# Altium project EtherIOv2.PrjPcb
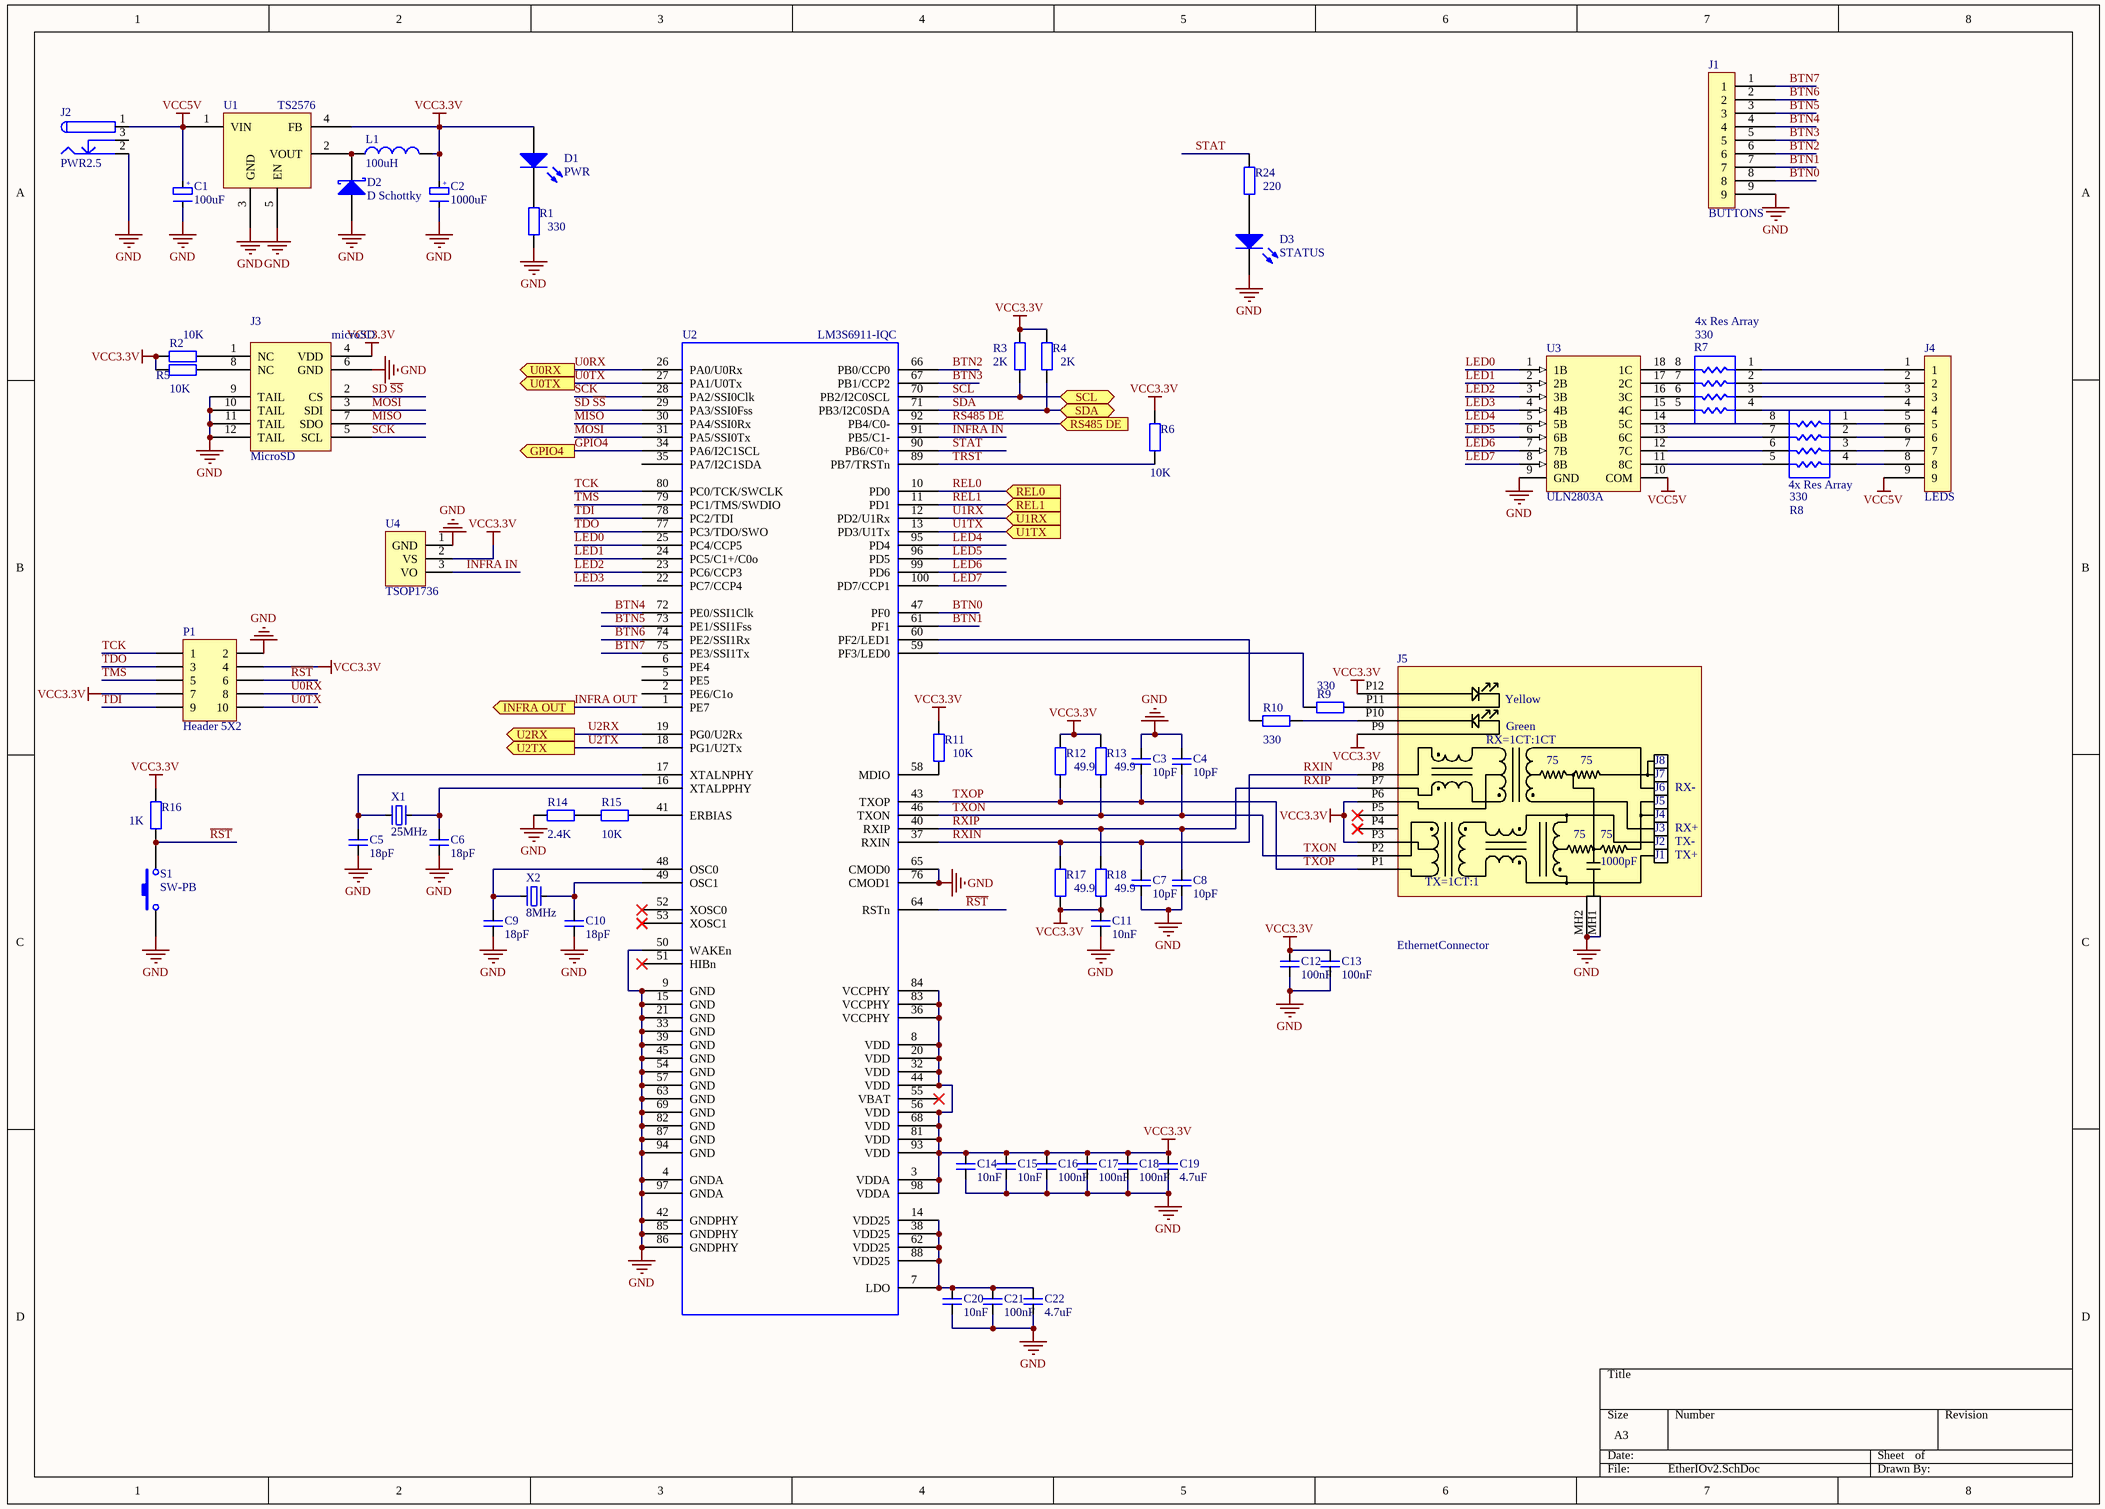
[diagram p0: EtherIOv2.SchDoc]
1 sheet, 58 parts. Net scope: flat (ports and power ports of the same name join across sheets).
Board file: EtherIOv2.PcbDoc

## Sheet EtherIOv2.SchDoc
size A3; PageSetup: Record=PageOptions|CenterHorizontal=True|CenterVertical=True|PrintScale=0.70|XCorrection=1.00|YCorrection=1.00|PrintKind=0|BorderSize=5000000|LeftOffset=0|BottomOffset=0|Orientation=2|PaperLength=1000|PaperWidth=1000|Scale=100|PaperSource=7|PrintQuality=-4|MediaType=1|DitherType=10|PaperKind=Letter|PrintScaleMode=1

### Parts
C1  value 100uF  [Electrolit Cap F80]  (hidden comment: 100uF_25V)
C2  value 1000uF  [Electrolit Cap J10]  (hidden comment: 1000uF_6V3)
C3  value 10pF  [0805 CAP]  (hidden comment: CAP)
C4  value 10pF  [0805 CAP]  (hidden comment: CAP)
C5  value 18pF  [0805 CAP]  (hidden comment: CAP)
C6  value 18pF  [0805 CAP]  (hidden comment: CAP)
C7  value 10pF  [0805 CAP]  (hidden comment: CAP)
C8  value 10pF  [0805 CAP]  (hidden comment: CAP)
C9  value 18pF  [0805 CAP]  (hidden comment: CAP)
C10  value 18pF  [0805 CAP]  (hidden comment: CAP)
C11  value 10nF  [0805 CAP]  (hidden comment: CAP)
C12  value 100nF  [0805 CAP]  (hidden comment: CAP)
C13  value 100nF  [0805 CAP]  (hidden comment: CAP)
C14  value 10nF  [0805 CAP]  (hidden comment: CAP)
C15  value 10nF  [0805 CAP]  (hidden comment: CAP)
C16  value 100nF  [0805 CAP]  (hidden comment: CAP)
C17  value 100nF  [0805 CAP]  (hidden comment: CAP)
C18  value 100nF  [0805 CAP]  (hidden comment: CAP)
C19  value 4.7uF  [0805 CAP]  (hidden comment: CAP)
C20  value 10nF  [0805 CAP]  (hidden comment: CAP)
C21  value 100nF  [0805 CAP]  (hidden comment: CAP)
C22  value 4.7uF  [0805 CAP]  (hidden comment: CAP)
D1  PWR  [0805 LED]
D2  D Schottky  [DSO-C2/X2.3]
D3  STATUS  [LED-1]
J1  BUTTONS  [Euroblock 3.5pitch 9P]
J2  PWR2.5  [KLD-0202]
J3  MicroSD  [microSD]
J4  LEDS  [Euroblock 3.5pitch 9P]
J5  EthernetConnector  [LU1T516-43]
L1  100uH  [INDP127127X85N]
P1  Header 5X2  [IDC2.54-V10D]
R1  value 330  [0805 RES]  (hidden comment: RES)
R2  value 10K  [0805 RES]  (hidden comment: RES)
R3  value 2K  [0805 RES]  (hidden comment: RES)
R4  value 2K  [0805 RES]  (hidden comment: RES)
R5  value 10K  [0805 RES]  (hidden comment: RES)
R6  value 10K  [0805 RES]  (hidden comment: RES)
R7  4x Res Array  value 330  [1206 4xRES ARRAY]
R8  4x Res Array  value 330  [1206 4xRES ARRAY]
R9  value 330  [0805 RES]  (hidden comment: RES)
R10  value 330  [0805 RES]  (hidden comment: RES)
R11  value 10K  [0805 RES]  (hidden comment: RES)
R12  value 49.9  [0805 RES]  (hidden comment: RES)
R13  value 49.9  [0805 RES]  (hidden comment: RES)
R14  value 2.4K  [0805 RES]  (hidden comment: RES)
R15  value 10K  [0805 RES]  (hidden comment: RES)
R16  value 1K  [0805 RES]  (hidden comment: RES)
R17  value 49.9  [0805 RES]  (hidden comment: RES)
R18  value 49.9  [0805 RES]  (hidden comment: RES)
R24  value 220  [0805 RES]  (hidden comment: RES)
S1  SW-PB  [SPST-2]
U1  TS2576  [TO-263-5L]
U2  LM3S6911-IQC  [QFP50P1600X1600X160-100N]
U3  ULN2803A  [SOIC127P1030X265-18N]
U4  TSOP1736  [TSOP17xx]
X1  value 25MHz  [CRYSTAL_LOW]  (hidden comment: CRYSTAL)
X2  value 8MHz  [CRYSTAL_LOW]  (hidden comment: CRYSTAL)

### Ports
GPIO4, INFRA OUT, REL0, REL1, RS485 DE, SCL, SDA, U0RX, U0TX, U1RX, U1TX, U2RX, U2TX

### Nets
GND: C1.1(B) C2.1(B) C3.2(B) C4.2(B) C5.1(A) C6.1(A) C7.2(B) C8.2(B) C9.1(A) C10.1(A) C11.1(A) C12.2(B) C13.2(B) C14.1(A) C15.1(A) C16.1(A) C17.1(A) C18.1(A) C19.1(A) C20.1(A) C21.1(A) C22.1(A) D2.1(A) D3.2(K) J1.9 J2.2 J3.6(GND) J3.9(TAIL) J3.10(TAIL) J3.11(TAIL) J3.12(TAIL) J5.MH1(SHIELD) J5.MH2(SHIELD) P1.2 R1.1 R14.1 S1.1 U1.3(GND) U1.5(EN) U2.4(GNDA) U2.9(GND) U2.15(GND) U2.21(GND) U2.33(GND) U2.39(GND) U2.42(GNDPHY) U2.45(GND) U2.50(WAKEn) U2.54(GND) U2.57(GND) U2.63(GND) U2.65(CMOD0) U2.69(GND) U2.76(CMOD1) U2.82(GND) U2.85(GNDPHY) U2.86(GNDPHY) U2.87(GND) U2.94(GND) U2.97(GNDA) U3.9(GND) U4.1(GND)
VCC3.3V: C2.2(A) C11.2(B) C12.1(A) C13.1(A) C14.2(B) C15.2(B) C16.2(B) C17.2(B) C18.2(B) C19.2(B) D1.1(A) J3.4(VDD) J5.P3 J5.P6 J5.P9 J5.P12 L1.2 P1.4 P1.7 R2.2 R3.2 R4.2 R5.2 R6.2 R11.2 R12.2 R13.2 R16.2 R17.2 R18.2 U1.4(FB) U2.3(VDDA) U2.8(VDD) U2.20(VDD) U2.32(VDD) U2.36(VCCPHY) U2.44(VDD) U2.56(VDD) U2.68(VDD) U2.81(VDD) U2.83(VCCPHY) U2.84(VCCPHY) U2.93(VDD) U2.98(VDDA) U4.2(VS)
VCC5V: C1.2(A) J2.1 J4.9 U1.1(VIN) U3.10(COM)
BTN0: J1.8 U2.47(PF0)
BTN1: J1.7 U2.61(PF1)
BTN2: J1.6 U2.66(PB0/CCP0)
BTN3: J1.5 U2.67(PB1/CCP2)
BTN4: J1.4 U2.72(PE0/SSI1Clk)
BTN5: J1.3 U2.73(PE1/SSI1Fss)
BTN6: J1.2 U2.74(PE2/SSI1Rx)
BTN7: J1.1 U2.75(PE3/SSI1Tx)
GPIO4: U2.34(PA6/I2C1SCL) ; port GPIO4
INFRA IN: U2.91(PB5/C1-) U4.3(VO)
INFRA OUT: U2.1(PE7) ; port INFRA OUT
LED0: U2.25(PC4/CCP5) U3.1(1B)
LED1: U2.24(PC5/C1+/C0o) U3.2(2B)
LED2: U2.23(PC6/CCP3) U3.3(3B)
LED3: U2.22(PC7/CCP4) U3.4(4B)
LED4: U2.95(PD4) U3.5(5B)
LED5: U2.96(PD5) U3.6(6B)
LED6: U2.99(PD6) U3.7(7B)
LED7: U2.100(PD7/CCP1) U3.8(8B)
MISO: J3.7(SDO) U2.30(PA4/SSI0Rx)
MOSI: J3.3(SDI) U2.31(PA5/SSI0Tx)
~{RST}: P1.6 R16.1 S1.2 U2.64(RSTn)
REL0: U2.10(PD0) ; port REL0
REL1: U2.11(PD1) ; port REL1
RS485 DE: U2.92(PB4/C0-) ; port RS485 DE
RXIN: C7.1(A) J5.P8 R17.1 U2.37(RXIN)
RXIP: C8.1(A) J5.P7 R18.1 U2.40(RXIP)
SCK: J3.5(SCL) U2.28(PA2/SSI0Clk)
SCL: R3.1 U2.70(PB2/I2C0SCL) ; port SCL
SD ~{SS}: J3.2(CS) U2.29(PA3/SSI0Fss)
SDA: R4.1 U2.71(PB3/I2C0SDA) ; port SDA
STAT: R24.2 U2.90(PB6/C0+)
~{TRST}: R6.1 U2.89(PB7/TRSTn)
TCK: P1.1 U2.80(PC0/TCK/SWCLK)
TDI: P1.9 U2.78(PC2/TDI)
TDO: P1.3 U2.77(PC3/TDO/SWO)
TMS: P1.5 U2.79(PC1/TMS/SWDIO)
TXON: C4.1(A) J5.P2 R13.1 U2.46(TXON)
TXOP: C3.1(A) J5.P1 R12.1 U2.43(TXOP)
U0RX: P1.8 U2.26(PA0/U0Rx) ; port U0RX
U0TX: P1.10 U2.27(PA1/U0Tx) ; port U0TX
U1RX: U2.12(PD2/U1Rx) ; port U1RX
U1TX: U2.13(PD3/U1Tx) ; port U1TX
U2RX: U2.19(PG0/U2Rx) ; port U2RX
U2TX: U2.18(PG1/U2Tx) ; port U2TX
NetC5_2: C5.2(B) U2.17(XTALNPHY) X1.1(A)
NetC6_2: C6.2(B) U2.16(XTALPPHY) X1.2(B)
NetC9_2: C9.2(B) U2.48(OSC0) X2.1(A)
NetC10_2: C10.2(B) U2.49(OSC1) X2.2(B)
NetC20_2: C20.2(B) C21.2(B) C22.2(B) U2.7(LDO) U2.14(VDD25) U2.38(VDD25) U2.62(VDD25) U2.88(VDD25)
NetD1_2: D1.2(K) R1.2
NetD2_2: D2.2(K) L1.1 U1.2(VOUT)
NetD3_1: D3.1(A) R24.1
NetJ3_1: J3.1(NC) R2.1
NetJ3_8: J3.8(NC) R5.1
NetJ4_1: J4.1 R7.1
NetJ4_2: J4.2 R7.2
NetJ4_3: J4.3 R7.3
NetJ4_4: J4.4 R7.4
NetJ4_5: J4.5 R8.1
NetJ4_6: J4.6 R8.2
NetJ4_7: J4.7 R8.3
NetJ4_8: J4.8 R8.4
NetJ5_P10: J5.P10 R10.2
NetJ5_P11: J5.P11 R9.2
NetR7_5: R7.5 U3.15(4C)
NetR7_6: R7.6 U3.16(3C)
NetR7_7: R7.7 U3.17(2C)
NetR7_8: R7.8 U3.18(1C)
NetR8_5: R8.5 U3.11(8C)
NetR8_6: R8.6 U3.12(7C)
NetR8_7: R8.7 U3.13(6C)
NetR8_8: R8.8 U3.14(5C)
NetR9_1: R9.1 U2.59(PF3/LED0)
NetR10_1: R10.1 U2.60(PF2/LED1)
NetR11_1: R11.1 U2.58(MDIO)
NetR14_2: R14.2 R15.1
NetR15_2: R15.2 U2.41(ERBIAS)

Not connected (* = marked no-connect by the designer): J2 3; J5 P4* P5*; U2 2(PE6/C1o) 5(PE5) 6(PE4) 35(PA7/I2C1SDA) 51(HIBn)* 52(XOSC0)* 53(XOSC1)* 55(VBAT)*

### Notes on the sheet
- (in symbol 100uF_25V) +
- (in symbol 1000uF_6V3) +
- (in symbol EthernetConnector) Yellow; Green; RX=1CT:1CT; 75; J8; J7; J6; RX-; J4; J3; RX+; J2; TX-; J1; TX+; 1000pF; TX=1CT:1
- (in symbol MicroSD) microSD

### Library data of the parts
C1 = 100uF_25V: SMD Electrolit Capacitor
C2 = 1000uF_6V3: SMD Electrolit Capacitor
C3-C22 = CAP: Capacitor
D1 = LED2: Typical RED, GREEN, YELLOW, AMBER GaAs LED; Published: 8-Jun-2000; LatestRevisionDate: 17-Jul-2002; LatestRevisionNote: Re-released for DXP Platform.; PackageVersion: Feb-2002; PackageReference: 3.2X1.6X1.1; Publisher: Altium Limited
D2 = D Schottky: Schottky Diode; Published: 8-Jun-2000; LatestRevisionDate: 17-Jul-2002; LatestRevisionNote: Re-released for DXP Platform.; PackageReference: SMB; Publisher: Altium Limited; Code_JEDEC: DO-214-AA
D3 = LED1: Typical RED GaAs LED; Published: 8-Jun-2000; LatestRevisionDate: 08-Jul-2005; LatestRevisionNote: Mech Layer 1 removed.; PackageReference: LED-1; Publisher: Altium Limited
J1 J4 = Euroblock 9P connector
J2 = PWR2.5: Low Voltage Power Supply Connector; Published: 17-Dec-2003; DatasheetDocument: 09-May-2002; Publisher: Altium Limited; ComponentLink1Description: Manufacturer Link; ComponentLink1URL: http://domino.kycon.com/internet/Products.html
L1 = Inductor: Code_IEC: 1005; Published: 8-Jun-2000; LatestRevisionDate: 29-May-2009; LatestRevisionNote: IPC-7351 Footprint Added.; PackageReference: 0402-A; Publisher: Altium Limited; PackageDescription: Chip Inductor; Code_JEITA: 0402
P1 = Header 5X2: Header, 5-Pin, Dual row; LatestRevisionDate: 17-Jul-2002; LatestRevisionNote: Re-released for DXP Platform.; Publisher: Altium Limited
R1-R6 R9-R18 R24 = RES: Resistor; Published: 8-Jun-2000; LatestRevisionDate: 17-Jul-2002; LatestRevisionNote: Re-released for DXP Platform.; PackageReference: AXIAL-0.4; Publisher: Altium Limited
R7 R8 = 4x Res Array: Isolated Resistor Network; Published: 24-Mar-1999; LatestRevisionDate: 29-May-2009; LatestRevisionNote: IPC-7351 Footprint Added.; PackageReference: SO-16; Publisher: Altium Limited; PackageDescription: 16-Pin Small Outline Integrated Circuit 1.27 mm Pitch; Code_JEDEC: MS-012-AC; Code_IPC: SOIC127P600-16
S1 = SW-PB: Switch; Published: 24-Mar-1999; LatestRevisionDate: 17-Jul-2002; LatestRevisionNote: Re-released for DXP Platform.; PackageReference: SPST-2; Publisher: Altium Limited
U1 = TS2576: Step Down DC-DC Converter
U2 = LM3S6611-IQC: Stellaris ARM Cortex-M3 Microcontroller; MFG: Luminary Micro; LMI Class: Fury; Ordering: LM3S6611-IQC
U3 = ULN2803A: 8xDarlington Driver
U4 = TSOP17xx: IR Receiver, 3-Pin; LatestRevisionDate: 17-Jul-2002; LatestRevisionNote: Re-released for DXP Platform.; Publisher: Altium Limited